# Altium schematic sheet EMS_TC_IO.SchDoc
size B; SheetNumber: 1; SheetTotal: 2
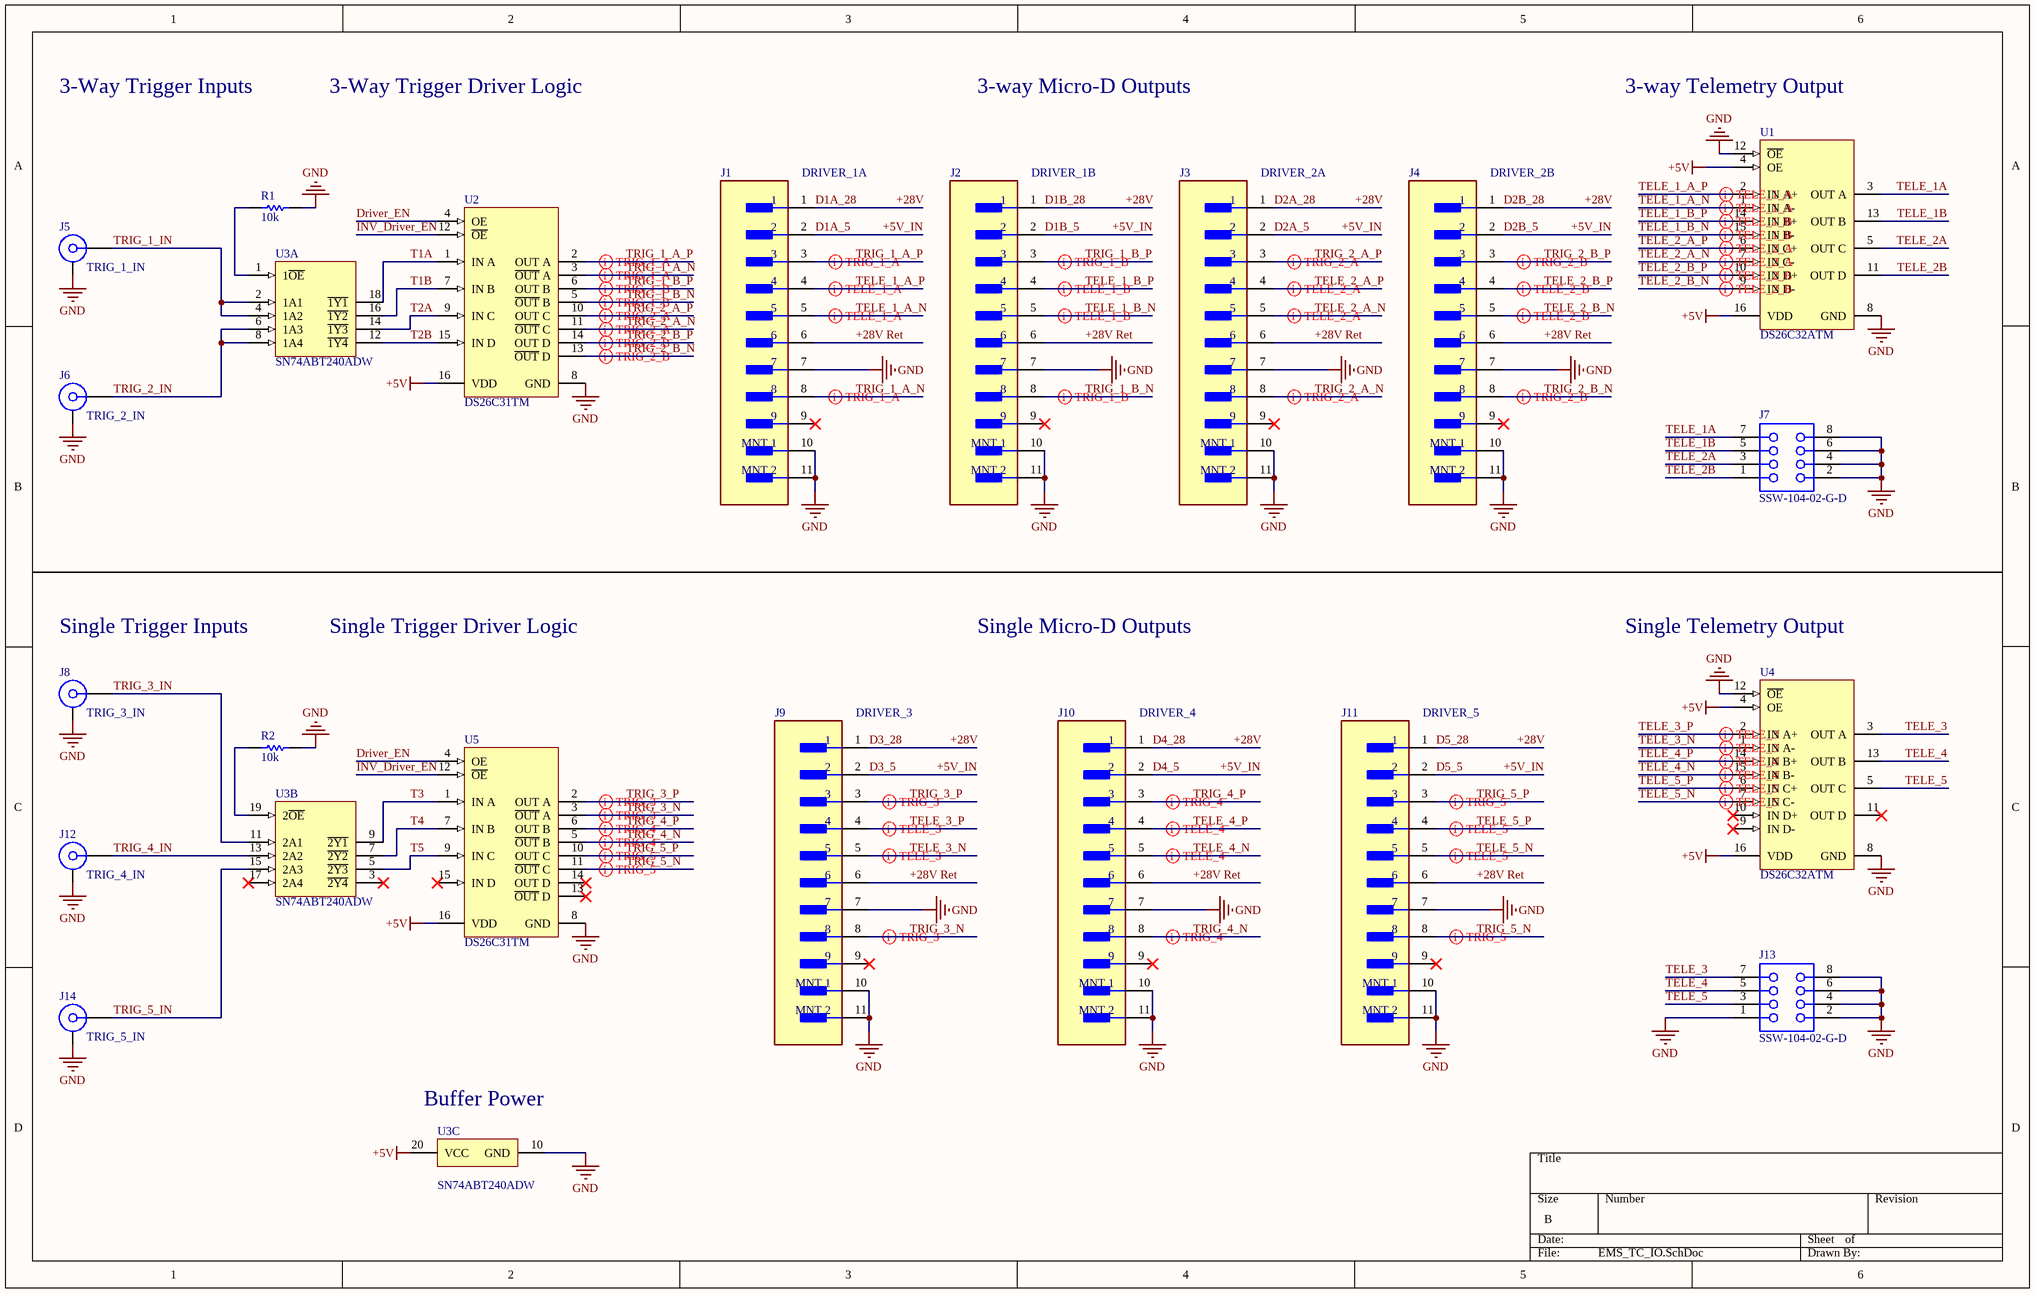
[diagram p0: EMS_TC_IO.SchDoc]

## Parts
J1  DRIVER_1A  [FP-381-009-112L565-MFG]
J2  DRIVER_1B  [FP-381-009-112L565-MFG]
J3  DRIVER_2A  [FP-381-009-112L565-MFG]
J4  DRIVER_2B  [FP-381-009-112L565-MFG]
J5  TRIG_1_IN  [ROS-51K204-400A5_V]
J6  TRIG_2_IN  [ROS-51K204-400A5_V]
J7  SSW-104-02-G-D  [SMTC-SSW-104-02-X-D]
J8  TRIG_3_IN  [ROS-51K204-400A5_V]
J9  DRIVER_3  [FP-381-009-112L565-MFG]
J10  DRIVER_4  [FP-381-009-112L565-MFG]
J11  DRIVER_5  [FP-381-009-112L565-MFG]
J12  TRIG_4_IN  [ROS-51K204-400A5_V]
J13  SSW-104-02-G-D  [SMTC-SSW-104-02-X-D]
J14  TRIG_5_IN  [ROS-51K204-400A5_V]
R1  10k  [RESC3116X65X40ML10T20]
R2  10k  [RESC3116X65X40ML10T20]
U1  DS26C32ATM  [D0016A_L]
U2  DS26C31TM  [D0016A_L]
U3  SN74ABT240ADW  [DW0020A_N]  (parts A,B,C of 3)
U4  DS26C32ATM  [D0016A_L]
U5  DS26C31TM  [D0016A_L]

## Nets
+5V: U1.4(OE) U1.16(VDD) U2.16(VDD) U3.20(VCC) U4.4(OE) U4.16(VDD) U5.16(VDD)
GND: J1.7 J1.10(MNT_1) J1.11(MNT_2) J2.7 J2.10(MNT_1) J2.11(MNT_2) J3.7 J3.10(MNT_1) J3.11(MNT_2) J4.7 J4.10(MNT_1) J4.11(MNT_2) J5.MH J6.MH J7.2 J7.4 J7.6 J7.8 J8.MH J9.7 J9.10(MNT_1) J9.11(MNT_2) J10.7 J10.10(MNT_1) J10.11(MNT_2) J11.7 J11.10(MNT_1) J11.11(MNT_2) J12.MH J13.1 J13.2 J13.4 J13.6 J13.8 J14.MH R1.2 R2.2 U1.8(GND) U1.12(~{OE}) U2.8(GND) U3.10(GND) U4.8(GND) U4.12(~{OE}) U5.8(GND)
+5V_IN: J1.2 J2.2 J3.2 J4.2 J9.2 J10.2 J11.2  [also labelled D1A_5, D1B_5, D2A_5, D2B_5, D3_5, D4_5, D5_5]
+28V: J1.1 J2.1 J3.1 J4.1 J9.1 J10.1 J11.1  [also labelled D1A_28, D1B_28, D2A_28, D2B_28, D3_28, D4_28, D5_28]
+28V Ret: J1.6 J2.6 J3.6 J4.6 J9.6 J10.6 J11.6
Driver_EN: U2.4(OE) U5.4(OE)
INV_Driver_EN: U2.12(~{OE}) U5.12(~{OE})
T1A: U2.1(IN_A) U3.18(~{1Y1})
T1B: U2.7(IN_B) U3.16(~{1Y2})
T2A: U2.9(IN_C) U3.14(~{1Y3})
T2B: U2.15(IN_D) U3.12(~{1Y4})
T3: U3.9(~{2Y1}) U5.1(IN_A)
T4: U3.7(~{2Y2}) U5.7(IN_B)
T5: U3.5(~{2Y3}) U5.9(IN_C)
TELE_1_A_N: J1.5 U1.1(IN_A-)
TELE_1_A_P: J1.4 U1.2(IN_A+)
TELE_1_B_N: J2.5 U1.15(IN_B-)
TELE_1_B_P: J2.4 U1.14(IN_B+)
TELE_1A: J7.7 U1.3(OUT_A)
TELE_1B: J7.5 U1.13(OUT_B)
TELE_2_A_N: J3.5 U1.7(IN_C-)
TELE_2_A_P: J3.4 U1.6(IN_C+)
TELE_2_B_N: J4.5 U1.9(IN_D-)
TELE_2_B_P: J4.4 U1.10(IN_D+)
TELE_2A: J7.3 U1.5(OUT_C)
TELE_2B: J7.1 U1.11(OUT_D)
TELE_3: J13.7 U4.3(OUT_A)
TELE_3_N: J9.5 U4.1(IN_A-)
TELE_3_P: J9.4 U4.2(IN_A+)
TELE_4: J13.5 U4.13(OUT_B)
TELE_4_N: J10.5 U4.15(IN_B-)
TELE_4_P: J10.4 U4.14(IN_B+)
TELE_5: J13.3 U4.5(OUT_C)
TELE_5_N: J11.5 U4.7(IN_C-)
TELE_5_P: J11.4 U4.6(IN_C+)
TRIG_1_A_N: J1.8 U2.3(~{OUT}_A)
TRIG_1_A_P: J1.3 U2.2(OUT_A)
TRIG_1_B_N: J2.8 U2.5(~{OUT}_B)
TRIG_1_B_P: J2.3 U2.6(OUT_B)
TRIG_1_IN: J5.1 U3.2(1A1) U3.4(1A2)
TRIG_2_A_N: J3.8 U2.11(~{OUT}_C)
TRIG_2_A_P: J3.3 U2.10(OUT_C)
TRIG_2_B_N: J4.8 U2.13(~{OUT}_D)
TRIG_2_B_P: J4.3 U2.14(OUT_D)
TRIG_2_IN: J6.1 U3.6(1A3) U3.8(1A4)
TRIG_3_IN: J8.1 U3.11(2A1)
TRIG_3_N: J9.8 U5.3(~{OUT}_A)
TRIG_3_P: J9.3 U5.2(OUT_A)
TRIG_4_IN: J12.1 U3.13(2A2)
TRIG_4_N: J10.8 U5.5(~{OUT}_B)
TRIG_4_P: J10.3 U5.6(OUT_B)
TRIG_5_IN: J14.1 U3.15(2A3)
TRIG_5_N: J11.8 U5.11(~{OUT}_C)
TRIG_5_P: J11.3 U5.10(OUT_C)
NetR1_1: R1.1 U3.1(1~{OE})
NetR2_1: R2.1 U3.19(2~{OE})

Not connected (* = marked no-connect by the designer): J1 9*; J2 9*; J3 9*; J4 9*; J9 9*; J10 9*; J11 9*; U3 3(~{2Y4})* 17(2A4)*; U4 9(IN_D-)* 10(IN_D+)* 11(OUT_D)*; U5 13(~{OUT}_D)* 14(OUT_D)* 15(IN_D)*

## Layout directives
differential pair; differential pair class TRIG_1_A; rule Differential Pairs Routing [Pref Gap = 6mil    Min Gap  = 6mil    Max Gap  = 10milPref Width = 6mil    Min Width  = 6mil    Max Width  = 15mil]: TRIG_1_A_N, TRIG_1_A_P
differential pair; rule Differential Pairs Routing [Pref Gap = 6mil    Min Gap  = 6mil    Max Gap  = 10milPref Width = 6mil    Min Width  = 6mil    Max Width  = 15mil]; differential pair class TRIG_1_B: TRIG_1_B_N, TRIG_1_B_P
differential pair; rule Differential Pairs Routing [Pref Gap = 6mil    Min Gap  = 6mil    Max Gap  = 10milPref Width = 6mil    Min Width  = 6mil    Max Width  = 15mil]; differential pair class TRIG_2_A: TRIG_2_A_N, TRIG_2_A_P
differential pair; rule Differential Pairs Routing [Pref Gap = 6mil    Min Gap  = 6mil    Max Gap  = 10milPref Width = 6mil    Min Width  = 6mil    Max Width  = 15mil]; differential pair class TRIG_2_B: TRIG_2_B_N, TRIG_2_B_P
differential pair; rule Differential Pairs Routing [Pref Gap = 6mil    Min Gap  = 6mil    Max Gap  = 10milPref Width = 6mil    Min Width  = 6mil    Max Width  = 15mil]; differential pair class TELE_1_A: TELE_1_A_N, TELE_1_A_P
differential pair; rule Differential Pairs Routing [Pref Gap = 6mil    Min Gap  = 6mil    Max Gap  = 10milPref Width = 6mil    Min Width  = 6mil    Max Width  = 15mil]; differential pair class TELE_1_B: TELE_1_B_N, TELE_1_B_P
differential pair; differential pair class TELE_2_A; rule Differential Pairs Routing [Pref Gap = 6mil    Min Gap  = 6mil    Max Gap  = 10milPref Width = 6mil    Min Width  = 6mil    Max Width  = 15mil]: TELE_2_A_N, TELE_2_A_P
differential pair; rule Differential Pairs Routing [Pref Gap = 6mil    Min Gap  = 6mil    Max Gap  = 10milPref Width = 6mil    Min Width  = 6mil    Max Width  = 15mil]; differential pair class TELE_2_B: TELE_2_B_N, TELE_2_B_P
differential pair; rule Differential Pairs Routing [Pref Gap = 6mil    Min Gap  = 6mil    Max Gap  = 10milPref Width = 6mil    Min Width  = 6mil    Max Width  = 15mil]; differential pair class TRIG_3: TRIG_3_N, TRIG_3_P
differential pair; rule Differential Pairs Routing [Pref Gap = 6mil    Min Gap  = 6mil    Max Gap  = 10milPref Width = 6mil    Min Width  = 6mil    Max Width  = 15mil]; differential pair class TRIG_4: TRIG_4_N, TRIG_4_P
differential pair; differential pair class TRIG_5; rule Differential Pairs Routing [Pref Gap = 6mil    Min Gap  = 6mil    Max Gap  = 10milPref Width = 6mil    Min Width  = 6mil    Max Width  = 15mil]: TRIG_5_N, TRIG_5_P
differential pair; differential pair class TELE_3; rule Differential Pairs Routing [Pref Gap = 6mil    Min Gap  = 6mil    Max Gap  = 10milPref Width = 6mil    Min Width  = 6mil    Max Width  = 15mil]: TELE_3_N, TELE_3_P
differential pair; differential pair class TELE_4; rule Differential Pairs Routing [Pref Gap = 6mil    Min Gap  = 6mil    Max Gap  = 10milPref Width = 6mil    Min Width  = 6mil    Max Width  = 15mil]: TELE_4_N, TELE_4_P
differential pair; differential pair class TELE_5; rule Differential Pairs Routing [Pref Gap = 6mil    Min Gap  = 6mil    Max Gap  = 10milPref Width = 6mil    Min Width  = 6mil    Max Width  = 15mil]: TELE_5_N, TELE_5_P

## Notes on the sheet
- 3-Way Trigger Inputs
- 3-Way Trigger Driver Logic
- 3-way Micro-D Outputs
- 3-way Telemetry Output
- Single Trigger Inputs
- Single Trigger Driver Logic
- Single Micro-D Outputs
- Single Telemetry Output
- (near U3) Buffer Power

## Library data of the parts
J1-J4 J9-J11 = CMP-42562-000005-1: CONN MICRO-D PLUG 9POS R/A SLDR; Manufacturer Part Number: 381-009-112L565; Manufacturer: NorComp Inc.; Conn Orientation: Right Angle; Voltage Rating: 500V; Conn Gender: Male; Number Of Contacts: 9; Shielding: true; Pitch: 1.27mm; Current Rating: 1A; RoHS: TRUE; Temperature Range Low: -55°C; Digikey Description: CONN MICRO-D PLUG 9POS R/A SLDR; ComponentLink2Description: Datasheet; Category: Conn; Octopart: https://octopart.com/381-009-112l565-norcomp-21388372; Automotive: No; Device Class L3: unset; Package: 381-009-112L565; Height: 8.003mm; Device Class L2: D-Sub Connectors; ComponentLink2URL: https://www.norcomp.net/rohspdfs/Micro-D/381-009-112L565.pdf; Contact Material: Gold,Nickel; Mouser Description: D-Sub Micro-D Connectors MICRO-D 9P R/A W/ STNDOFF/BRDLK; Temperature: -55°C to +85°C; Temperature Range High: +85°C; Device Class L1: Connectors; Lead Free: Yes
J5 J6 J8 J12 J14 = CMP-0753-00004-1: BNC 50R Right Angle Jack, Panel Feedthrough, Up to 10 GHz, -55 to 155 degC; PartNumber: 51K204-400A5; Manufacturer: Rosenberger; Design Note: Footprint in library is a generic example - only application specific footprint delivers High Performance; PackageReference: 51K204-400A5; DatasheetVersion: d00; ComponentLink2Description: Datasheet; ComponentLink5Description: Webshop / RFQ; ComponentLink1URL: http://www.rosenberger.de; ComponentLink4URL: http://rosenberger.de/ok/images/documents/spez/51.pdf; PackageVersion: d00; ComponentLink5URL: http://www.rosenberger.com/en/contact/sales/; ComponentLink3URL: http://rosenberger.de/ok/images/documents/db/51K204-400A5.pdf; ComponentLink2URL: http://rosenberger.de/ok/images/documents/db/51K204-400A5.pdf; ComponentLink1Description: Manufacturer URL; Mounting Technology: Through Hole; PackageDescription: 50R BNC Right Angle Jack, 12.5 x 32.6 x 14.5 mm; ComponentLink4Description: Series Overview / Design Note; ComponentLink3Description: Package Specification
J7 J13 = CMP-1023-00343-1: SQ Post Socket, Through-hole, Vertical, -55 to 125 degC, 2.54mm Pitch, 8-Pin, Female, RoHS; Manufacturer: Samtec; Mounting Technology: Through-hole; ComponentLink1Description: Manufacturer URL; Orientation: Vertical; Pitch: 2.54 mm; PartNumber: SSW-104-02-G-D; ComponentLink2URL: http://www.samtec.com/documents/webfiles/pdf/SSW_TH.PDF; PackageReference: SSW-104-02-X-D; ComponentLink3Description: Package Specification; PackageVersion: CA, 6/1987; PackageDescription: Assembly, Socket Strip .016 X .031 Tail; ComponentLink2Description: Datasheet; RoHS: True; ComponentLink1URL: http://www.samtec.com; ComponentLink3URL: http://www.samtec.com/documents/webfiles/cpdf/SSW-1XX-XX-XXX-X-XX-XXX-XX-MKT.pdf; DatasheetVersion: F-214; Temperature Range: -55 to 125 degC
R1 R2 = CMP-1014-00623-2: Chip Resistor, 10 KOhm, +/- 1%, 0.25 W, -55 to 155 degC, 1206 (3216 Metric), RoHS, Tape and Reel; Manufacturer: Yageo; Voltage Rating: 200V; Resistance: 10KOhm; Temperature Coefficient: 100ppm/degreesC; Power Rating: 250mW; Packaging: TapeandReel; Termination: SMD/SMT; REACH SVHC: Unknown; Tolerance: 1%; Height: 0.55mm; Composition: ThickFilm; Max Operating Temperature: 155degC; Datasheet Version: Rev. 5, 10/2016; Lead Free: LeadFree; Case Code (Metric): 3216; Depth: 1.6mm; Package Quantity: 5000; RoHSCompliant: true; Military Standard: Not; Case/Package: 1206; Case Code (Imperial): 1206; Min Operating Temperature: -55degC; Datasheet URL: http://www.yageo.com/NewPortal/yageodocoutput?fileName=/pdf/R-Chip/PYu-RC_Group_51_RoHS_L_5.pdf; Length: 3.1mm; Manufacturer URL: http://www.yageo.com/; Package Reference: 1206.0; Width: 1.6mm; Package Description: 2-Pin Surface Mount Device, Body 3.1 x 1.6 mm
U1 U4 = CMP-0058-00986-3: CMOS Quad Differential Line Receiver, 16-pin Narrow SOIC; Manufacturer: Texas Instruments; CompType: Interface IC; PowerWise: N; PackageTopMarking: NSUZXYTTE#*DS26C32ATM; Code_JEDEC: MS-012-AC; ComponentLink1Description: Datasheet URL; RoHS: N; Code_IPC: SOIC127P600-16; PackageReference: D0016A; PinCount: 16; ComponentLink1URL: http://www.ti.com/general/docs/lit/getliterature.tsp?genericPartNumber=DS26C32AT&fileType=pdf; PackageDescription: Molded Package, SO, .150in Wide, 16 Lead
U2 U5 = CMP-0058-00990-3: CMOS Quad Tri-State Differential Line Driver, 16-pin Narrow SOIC; Manufacturer: Texas Instruments; CompType: Interface IC; PackageTopMarking: NSUZXYTTE#*DS26C31TM; PowerWise: N; PinCount: 16; ComponentLink1URL: http://www.ti.com/general/docs/lit/getliterature.tsp?genericPartNumber=DS26C31T&fileType=pdf; PackageDescription: Molded Package, SO, .150in Wide, 16 Lead; Code_JEDEC: MS-012-AC; ComponentLink1Description: Datasheet URL; RoHS: N; Code_IPC: SOIC127P600-16; PackageReference: D0016A
U3 = CMP-1615-00030-3: Octal Buffers/Drivers With 3-State Outputs, DW0020A, TUBE; Manufacturer: Texas Instruments; Schmitt Trigger: No; Voltage(Nom)(V): 5; VCC(Max)(V): 5.5; Input Type: TTL; tpd @ Nom Voltage(Max)(ns): 4.8; Bits(#): 8; Rating: Catalog; F @ Nom Voltage(Max)(Mhz): 150; Output Drive (IOL/IOH)(Max)(mA): -32/64; ICC @ Nom Voltage(Max)(mA): 0.0055; VCC(Min)(V): 4.5; Technology Family: ABT; PackageReference: DW0020A; Generic Part Number: SN74ABT240A; Code_JEDEC: MS-013; DatasheetVersion: SCBS098I; Operating Temperature Range(C): -40 to 85; Output Type: TTL